# Altium schematic sheet QCPower Rev A Sht2 BLDC Controller.SchDoc
size A2
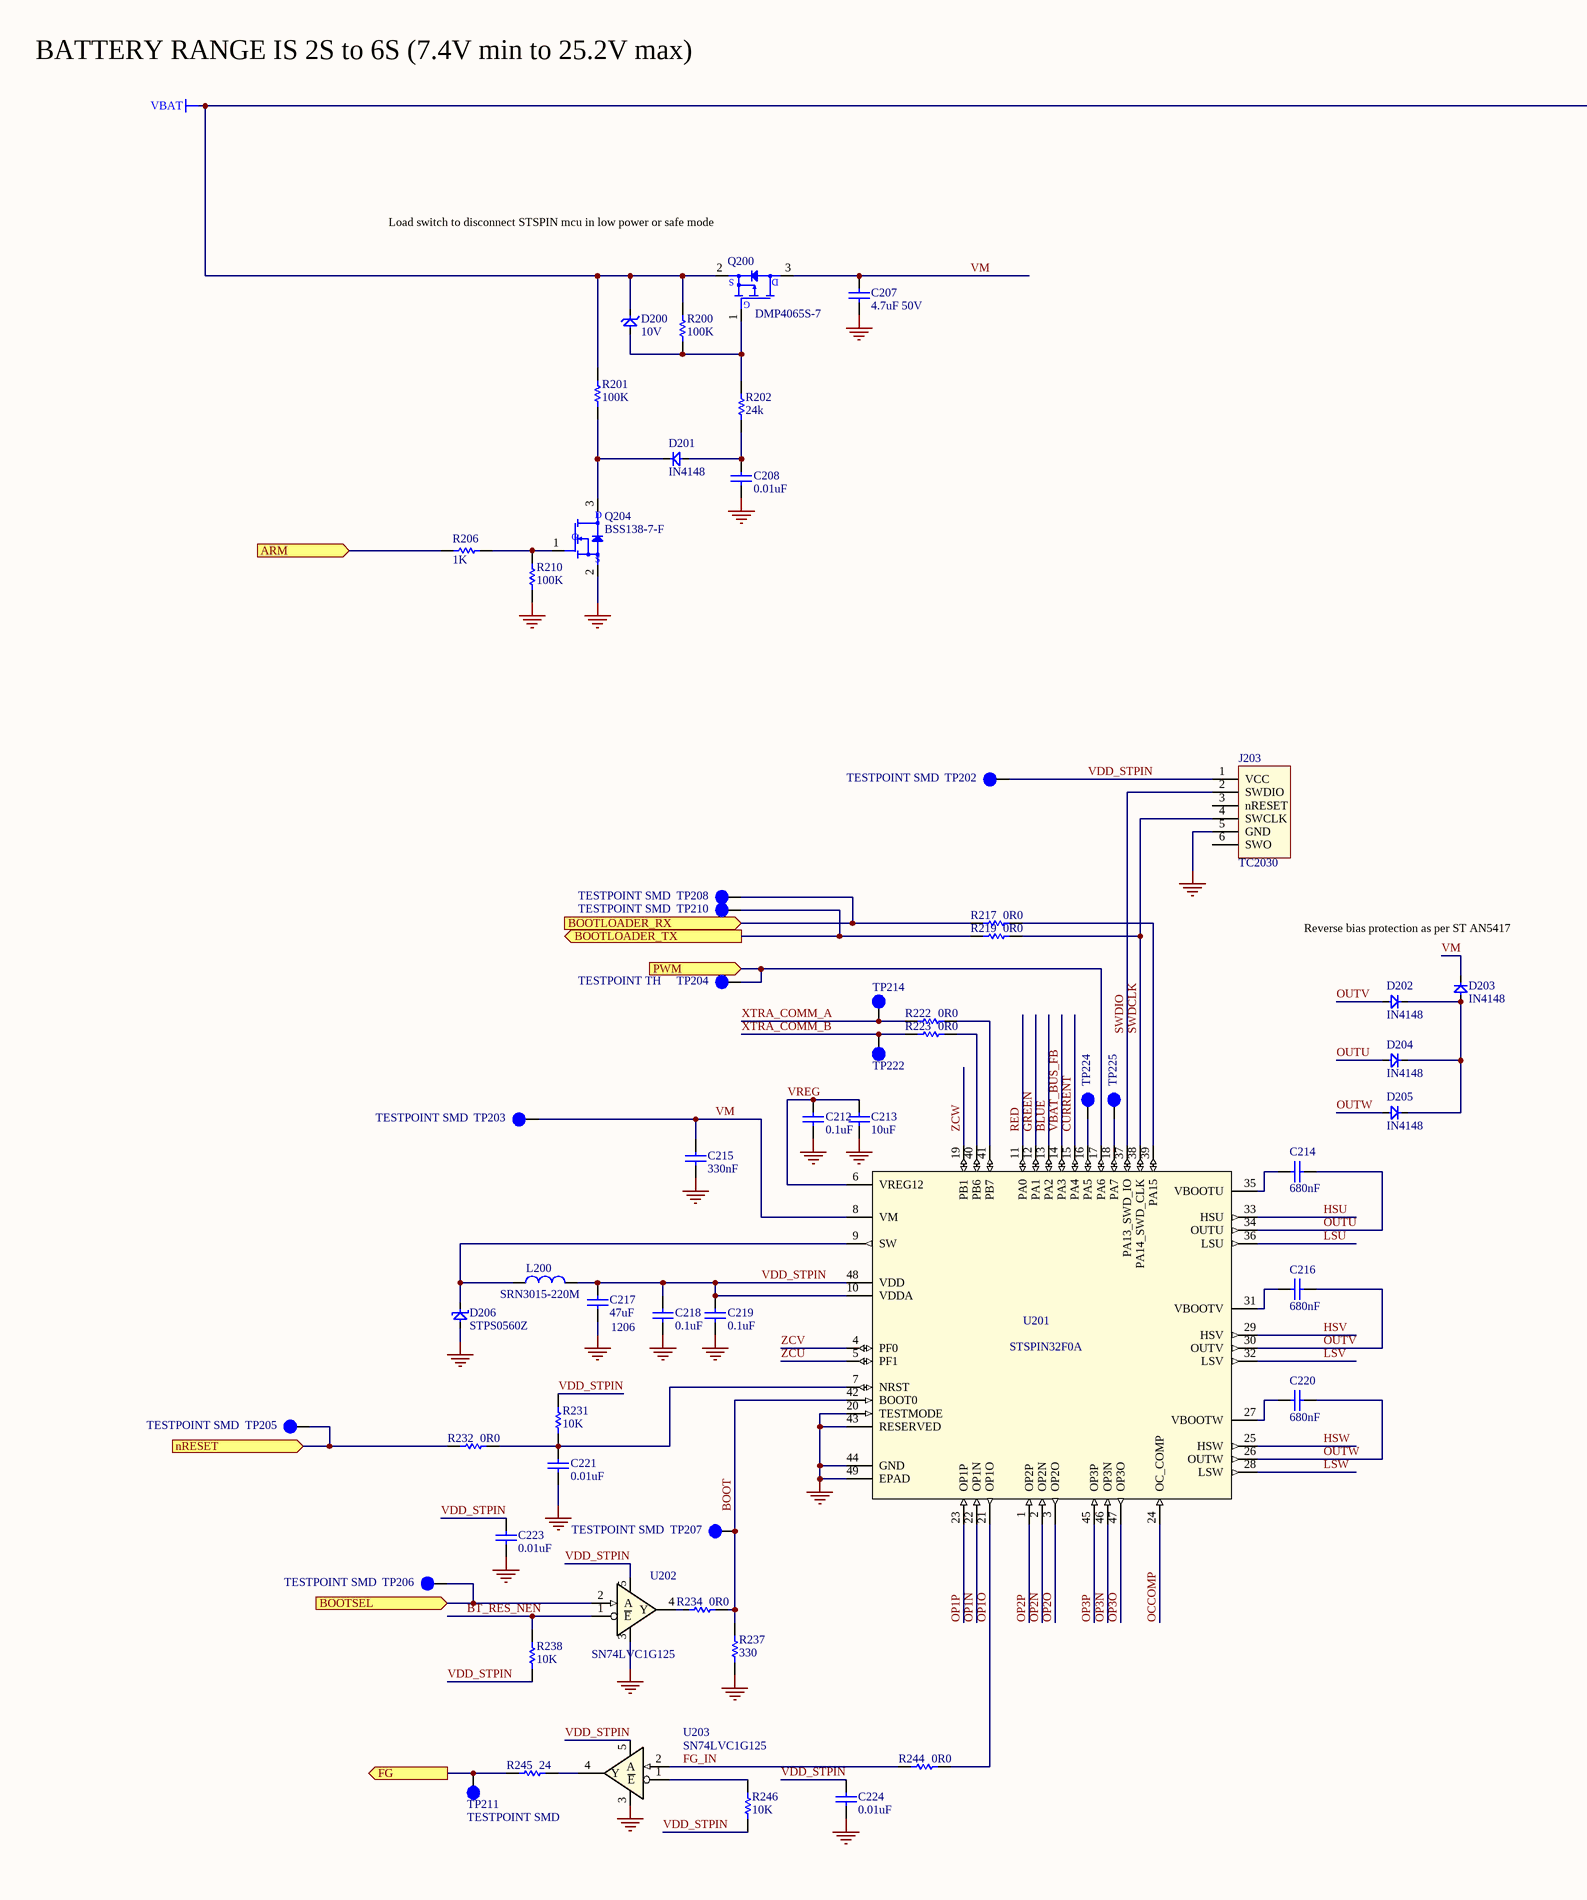
[diagram p0: QCPower Rev A Sht2 BLDC Controller.SchDoc, left]
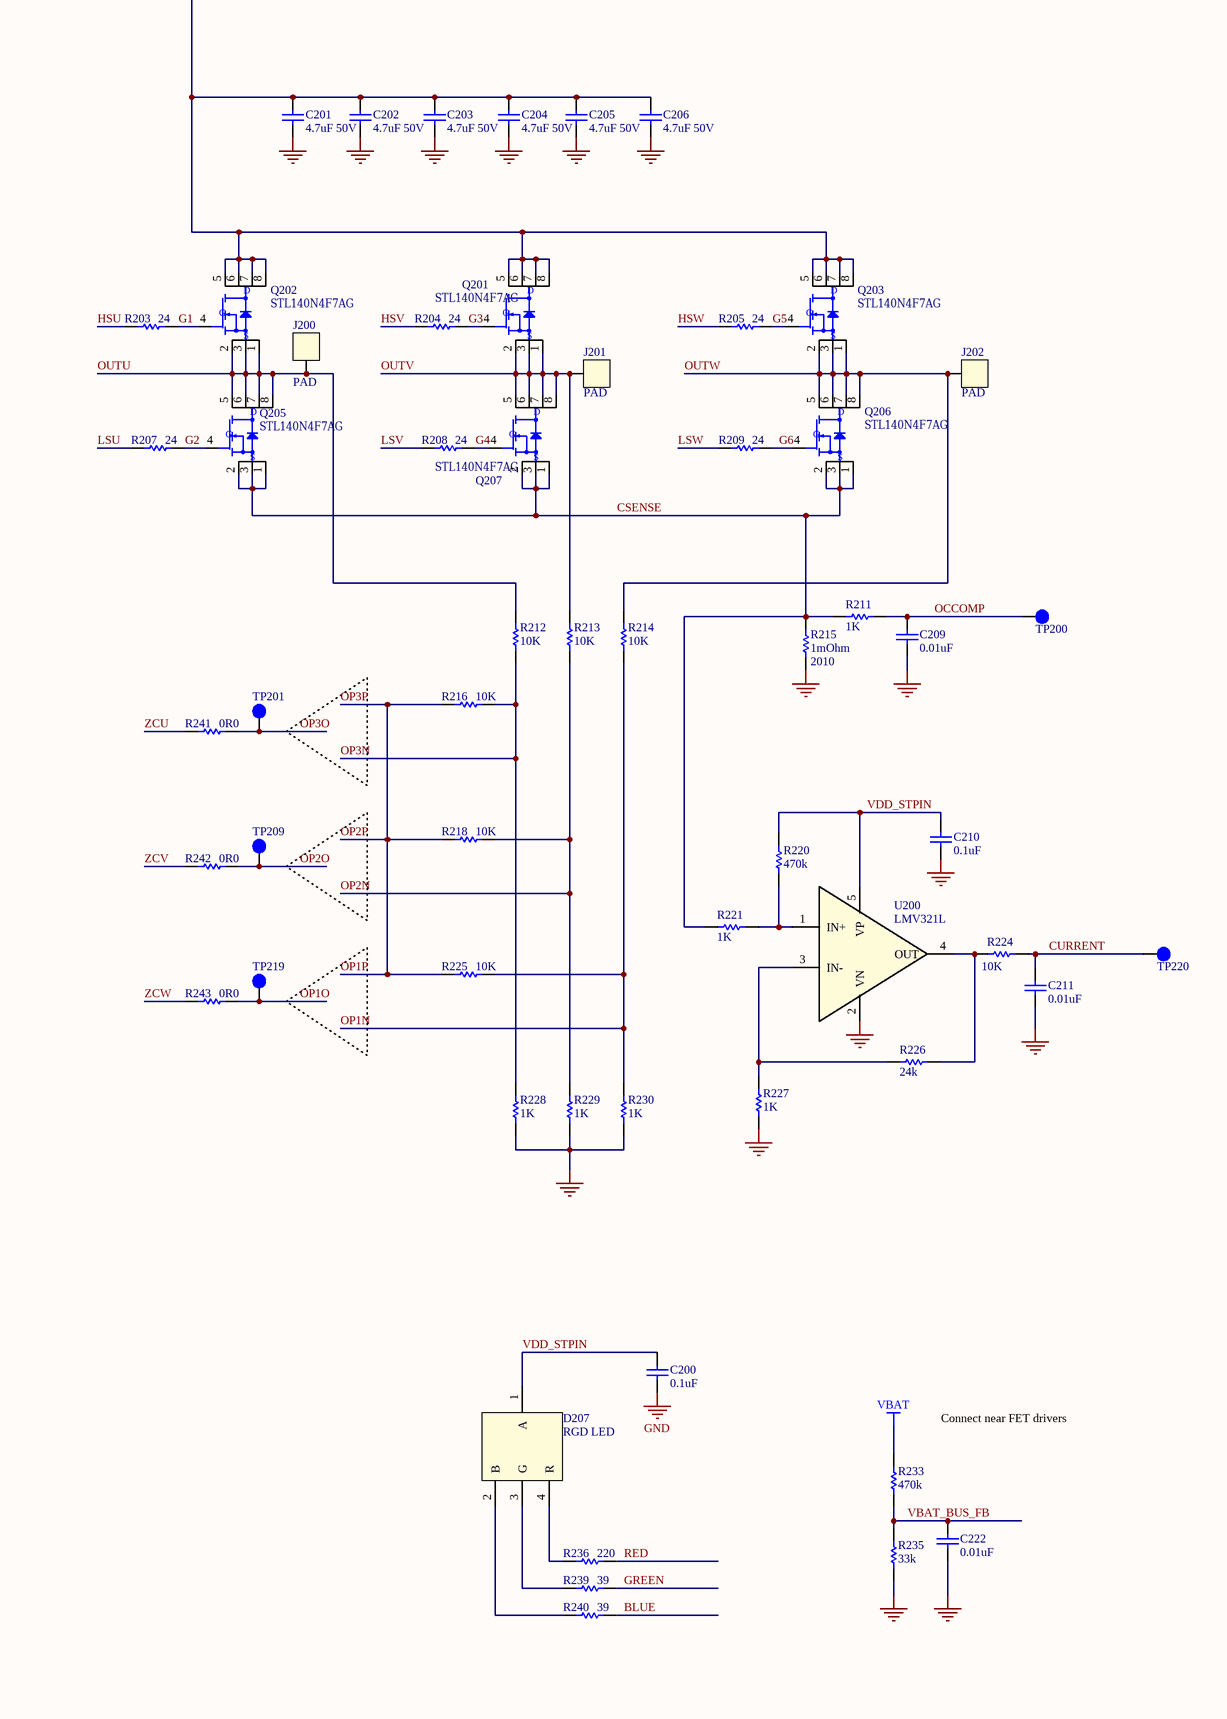
[diagram p1: QCPower Rev A Sht2 BLDC Controller.SchDoc, right]

## Parts
C200  0.1uF  [SMD CAP 0402]
C201  4.7uF 50V  [SMD CAP 0805]
C202  4.7uF 50V  [SMD CAP 0805]
C203  4.7uF 50V  [SMD CAP 0805]
C204  4.7uF 50V  [SMD CAP 0805]
C205  4.7uF 50V  [SMD CAP 0805]
C206  4.7uF 50V  [SMD CAP 0805]
C207  4.7uF 50V  [SMD CAP 0805]
C208  0.01uF  [SMD CAP 0402]
C209  0.01uF  [SMD CAP 0402]
C210  0.1uF  [SMD CAP 0402]
C211  0.01uF  [SMD CAP 0402]
C212  0.1uF  [SMD CAP 0402]
C213  10uF  [SMD CAP 0805]
C214  680nF  [SMD CAP 0603]
C215  330nF  [SMD CAP 0603]
C216  680nF  [SMD CAP 0603]
C217  47uF  4. Package: 1206  [SMD CAP 1206]
C218  0.1uF  [SMD CAP 0402]
C219  0.1uF  [SMD CAP 0402]
C220  680nF  [SMD CAP 0603]
C221  0.01uF  [SMD CAP 0402]
C222  0.01uF  [SMD CAP 0402]
C223  0.01uF  [SMD CAP 0402]
C224  0.01uF  [SMD CAP 0402]
D200  10V  [DIODE SOD-523]
D201  IN4148  [DIODE SOD-523]
D202  IN4148  [DIODE SOD-523]
D203  IN4148  [DIODE SOD-523]
D204  IN4148  [DIODE SOD-523]
D205  IN4148  [DIODE SOD-523]
D206  STPS0560Z  [DIODE SOD123]
D207  RGD LED  [PLCC-4 LED ASMB-MTB0-0A3A2]
J200  PAD  [CONN SOLDER MOTOR]  (no BOM)
J201  PAD  [CONN SOLDER MOTOR]  (no BOM)
J202  PAD  [CONN SOLDER MOTOR]  (no BOM)
J203  TC2030  [tag-connect-6]
L200  SRN3015-220M  [INDUCTOR SRN3015-220M]
Q200  DMP4065S-7  [SOT-23-3]
Q201  STL140N4F7AG‎  [PowerFLAT 5x6]
Q202  STL140N4F7AG‎  [PowerFLAT 5x6]
Q203  STL140N4F7AG‎  [PowerFLAT 5x6]
Q204  BSS138-7-F  [SOT-23-3]
Q205  STL140N4F7AG‎  [PowerFLAT 5x6]
Q206  STL140N4F7AG‎  [PowerFLAT 5x6]
Q207  STL140N4F7AG‎  [PowerFLAT 5x6]
R200  100K  [SMD RES 0402]
R201  100K  [SMD RES 0402]
R202  24k  [SMD RES 0402]
R203  24  [SMD RES 0402]
R204  24  [SMD RES 0402]
R205  24  [SMD RES 0402]
R206  1K  [SMD RES 0402]
R207  24  [SMD RES 0402]
R208  24  [SMD RES 0402]
R209  24  [SMD RES 0402]
R210  100K  [SMD RES 0402]
R211  1K  [SMD RES 0402]
R212  10K  [SMD RES 0402]
R213  10K  [SMD RES 0402]
R214  10K  [SMD RES 0402]
R215  1mOhm  4. Package: 2010  [SMD RES 2010]
R216  10K  [SMD RES 0402]
R217  0R0  [SMD RES 0402]
R218  10K  [SMD RES 0402]
R219  0R0  [SMD RES 0402]
R220  470k  [SMD RES 0402]
R221  1K  [SMD RES 0402]
R222  0R0  [SMD RES 0402]
R223  0R0  [SMD RES 0402]
R224  10K  [SMD RES 0402]
R225  10K  [SMD RES 0402]
R226  24k  [SMD RES 0402]
R227  1K  [SMD RES 0402]
R228  1K  [SMD RES 0402]
R229  1K  [SMD RES 0402]
R230  1K  [SMD RES 0402]
R231  10K  [SMD RES 0402]
R232  0R0  [SMD RES 0402]
R233  470k  [SMD RES 0402]
R234  0R0  [SMD RES 0402]
R235  33k  [SMD RES 0402]
R236  220  [SMD RES 0402]
R237  330  [SMD RES 0402]
R238  10K  [SMD RES 0402]
R239  39  [SMD RES 0402]
R240  39  [SMD RES 0402]
R241  0R0  [SMD RES 0402]
R242  0R0  [SMD RES 0402]
R243  0R0  [SMD RES 0402]
R244  0R0  [SMD RES 0402]
R245  24  [SMD RES 0402]
R246  10K  [SMD RES 0402]
TP200  TESTPOINT SMD  [TESTPOINT 0.5mm DIA]  (value not drawn)  (no BOM)
TP201  TESTPOINT SMD  [TESTPOINT 0.5mm DIA]  (value not drawn)  (no BOM)
TP202  TESTPOINT SMD  [TESTPOINT 0.5mm DIA]  (no BOM)
TP203  TESTPOINT SMD  [TESTPOINT 0.5mm DIA]  (no BOM)
TP204  TESTPOINT TH  [TESTPOINT TH]
TP205  TESTPOINT SMD  [TESTPOINT 0.5mm DIA]  (no BOM)
TP206  TESTPOINT SMD  [TESTPOINT 0.5mm DIA]  (no BOM)
TP207  TESTPOINT SMD  [TESTPOINT 0.5mm DIA]  (no BOM)
TP208  TESTPOINT SMD  [TESTPOINT 0.5mm DIA]  (no BOM)
TP209  TESTPOINT SMD  [TESTPOINT 0.5mm DIA]  (value not drawn)  (no BOM)
TP210  TESTPOINT SMD  [TESTPOINT 0.5mm DIA]  (no BOM)
TP211  TESTPOINT SMD  [TESTPOINT 0.5mm DIA]  (no BOM)
TP214  TESTPOINT SMD  [TESTPOINT 0.5mm DIA]  (value not drawn)  (no BOM)
TP219  TESTPOINT SMD  [TESTPOINT 0.5mm DIA]  (value not drawn)  (no BOM)
TP220  TESTPOINT SMD  [TESTPOINT 0.5mm DIA]  (value not drawn)  (no BOM)
TP222  TESTPOINT SMD  [TESTPOINT 0.5mm DIA]  (value not drawn)  (no BOM)
TP224  TESTPOINT SMD  [TESTPOINT 0.5mm DIA]  (value not drawn)  (no BOM)
TP225  TESTPOINT SMD  [TESTPOINT 0.5mm DIA]  (value not drawn)  (no BOM)
U200  LMV321L  [SOT-23-5]
U201  STSPIN32F0A  [VQFN-48 7x7]
U202  SN74LVC1G125  [SC70-5]
U203  SN74LVC1G125  [SC70-5]

## Ports
ARM (in), BOOTLOADER_RX (in), BOOTLOADER_TX (out), BOOTSEL (in), FG (out), nRESET (in), PWM (in)

## Nets
GND: C200.1 C201.2 C202.2 C203.2 C204.2 C205.2 C206.2 C207.2 C208.2 C209.2 C210.1 C211.2 C212.1 C213.2 C215.2 C217.2 C218.1 C219.1 C221.2 C222.2 C223.2 C224.2 D206.A J203.5(GND) Q204.2 R210.2 R215.1 R227.2 R228.1 R229.1 R230.1 R235.2 R237.1 U200.2(VN) U201.20(TESTMODE) U201.43(RESERVED) U201.44(GND) U201.49(EPAD) U202.3(GND) U203.3(GND)
VBAT: C201.1 C202.1 C203.1 C204.1 C205.1 C206.1 D200.K Q200.2 Q201.5(D) Q201.6(D) Q201.7(D) Q201.8(D) Q202.5(D) Q202.6(D) Q202.7(D) Q202.8(D) Q203.5(D) Q203.6(D) Q203.7(D) Q203.8(D) R200.1 R201.1 R233.1
ARM: R206.2 ; port ARM
BLUE: R240.2 U201.13(PA2)
BOOT: R234.2 R237.2 TP207.1 U201.42(BOOT0)
BOOTLOADER_RX: R217.1 TP208.1 ; port BOOTLOADER_RX
BOOTLOADER_TX: R219.1 TP210.1 ; port BOOTLOADER_TX
BOOTSEL: TP206.1 U202.2(A) ; port BOOTSEL
BT_RES_NEN: R238.1 U202.1(~{E})
CSENSE: Q205.1(S) Q205.2(S) Q205.3(S) Q206.1(S) Q206.2(S) Q206.3(S) Q207.1(S) Q207.2(S) Q207.3(S) R211.2 R215.2 R221.2
CURRENT: C211.1 R224.2 TP220.1 U201.15(PA4)
FG: R245.1 TP211.1 ; port FG
FG_IN: R244.1 U203.2(A)
G1: Q202.4(G) R203.2
G2: Q205.4(G) R207.2
G3: Q201.4(G) R204.2
G4: Q207.4(G) R208.2
G5: Q203.4(G) R205.2
G6: Q206.4(G) R209.2
GREEN: R239.2 U201.12(PA1)
HSU: R203.1 U201.33(HSU)
HSV: R204.1 U201.29(HSV)
HSW: R205.1 U201.25(HSW)
LSU: R207.1 U201.36(LSU)
LSV: R208.1 U201.32(LSV)
LSW: R209.1 U201.28(LSW)
nRESET: R232.1 TP205.1 ; port nRESET
OCCOMP: C209.1 R211.1 TP200.1 U201.24(OC_COMP)
OP1N: R214.2 R225.1 R230.2 U201.22(OP1N)
OP1O: R243.2 R244.2 TP219.1 U201.21(OP1O)
OP1P: R216.2 R218.2 R225.2 U201.1(OP2P) U201.23(OP1P) U201.45(OP3P)  [also labelled OP2P, OP3P]
OP2N: R213.2 R218.1 R229.2 U201.2(OP2N)
OP2O: R242.2 TP209.1 U201.3(OP2O)
OP3N: R212.2 R216.1 R228.2 U201.46(OP3N)
OP3O: R241.2 TP201.1 U201.47(OP3O)
OUTU: C214.2 D204.A J200.1 Q202.1(S) Q202.2(S) Q202.3(S) Q205.5(D) Q205.6(D) Q205.7(D) Q205.8(D) R212.1 U201.34(OUTU)
OUTV: C216.2 D202.A J201.1 Q201.1(S) Q201.2(S) Q201.3(S) Q207.5(D) Q207.6(D) Q207.7(D) Q207.8(D) R213.1 U201.30(OUTV)
OUTW: C220.2 D205.A J202.1 Q203.1(S) Q203.2(S) Q203.3(S) Q206.5(D) Q206.6(D) Q206.7(D) Q206.8(D) R214.1 U201.26(OUTW)
PWM: TP204.1 U201.17(PA6) ; port PWM
RED: R236.2 U201.11(PA0)
SWDCLK: J203.4(SWCLK) R219.2 U201.38(PA14_SWD_CLK)
SWDIO: J203.2(SWDIO) U201.37(PA13_SWD_IO)
VBAT_BUS_FB: C222.1 R233.2 R235.1 U201.14(PA3)
VDD_STPIN: C200.2 C210.2 C217.1 C218.2 C219.2 C223.1 C224.1 D207.1(A) J203.1(VCC) L200.2 R220.1 R231.1 R238.2 R246.2 TP202.1 U200.5(VP) U201.10(VDDA) U201.48(VDD) U202.5(VCC) U203.5(VCC)
VM: C207.1 C215.1 D203.K Q200.3 TP203.1 U201.8(VM)
VREG: C212.2 C213.1 U201.6(VREG12)
XTRA_COMM_A: R222.1 TP214.1
XTRA_COMM_B: R223.1 TP222.1
ZCU: R241.1 U201.5(PF1)
ZCV: R242.1 U201.4(PF0)
ZCW: R243.1 U201.19(PB1)
NetC208_1: C208.1 D201.A R202.1
NetC214_1: C214.1 U201.35(VBOOTU)
NetC216_1: C216.1 U201.31(VBOOTV)
NetC220_1: C220.1 U201.27(VBOOTW)
NetC221_1: C221.1 R231.2 R232.2 U201.7(NRST)
NetD200_A: D200.A Q200.1 R200.2 R202.2
NetD201_K: D201.K Q204.3 R201.2
NetD202_K: D202.K D203.A D204.K D205.K
NetD206_K: D206.K L200.1 U201.9(SW)
NetD207_2: D207.2(B) R240.1
NetD207_3: D207.3(G) R239.1
NetD207_4: D207.4(R) R236.1
NetQ204_1: Q204.1(G) R206.1 R210.1
NetR217_2: R217.2 U201.39(PA15)
NetR220_2: R220.2 R221.1 U200.1(IN+)
NetR222_2: R222.2 U201.41(PB7)
NetR223_2: R223.2 U201.40(PB6)
NetR224_1: R224.1 R226.2 U200.4(OUT)
NetR226_1: R226.1 R227.1 U200.3(IN-)
NetR234_1: R234.1 U202.4(Y)
NetR245_2: R245.2 U203.4(Y)
NetR246_1: R246.1 U203.1(~{E})
NetTP224_1: TP224.1 U201.16(PA5)
NetTP225_1: TP225.1 U201.18(PA7)

Not connected (* = marked no-connect by the designer): J203 3(nRESET) 6(SWO)

## Notes on the sheet
- BATTERY RANGE IS 2S to 6S (7.4V min to 25.2V max)
- (near Q200) Load switch to disconnect STSPIN mcu in low power or safe mode
- Reverse bias protection as per ST AN5417
- Connect near FET drivers
- (in symbol TRANS FET N-CH 50V 200MA SOT23-3 BSS138-7-F) D; S
- (in symbol TRANS FET P-CH 40V 2.4A SOT23-3) S; D; G

## Library data of the parts
C200 C210 C212 C218 C219 = CAP MLCC SMD: CAP CER 0.1UF 25V X7R 0402; 1. Manufacturer: Yageo; 2. Manufacturer Part Number: CC0402KRX7R8BB104; 4. Package: 0402; 3. Date Modified: 20201122
C201-C207 = CAP MLCC SMD: CAP CER 4.7UF 50V X5R 0805; 1. Manufacturer: Samsung Electro-Mechanics; 2. Manufacturer Part Number: CL21A475KBQNNNE; 4. Package: 0805; 3. Date Modified: 20201125
C208 C209 C211 C221-C224 = CAP MLCC SMD: CAP CER 10000PF 16V X7R 0402; 1. Manufacturer: Walsin Technology Corporation; 2. Manufacturer Part Number: 0402B103K160CT; 4. Package: 0402; 3. Date Modified: 20201122
C213 = CAP MLCC SMD: CAP CER 10UF 25V X5R 0805; 1. Manufacturer: Taiyo Yuden; 2. Manufacturer Part Number: TMK212BBJ106KG-T; 4. Package: 0805; 3. Date Modified: 20201219
C214 C216 C220 = CAP MLCC SMD: CAP CER 0.68UF 25V X7R 0603; 1. Manufacturer: TDK Corporation; 2. Manufacturer Part Number: CGA3E1X7R1E684K080AC; 4. Package: 0603; 3. Date Modified: 20201125
C215 = CAP MLCC SMD: CAP CER 0.33UF 50V X7R 0603; 1. Manufacturer: TDK Corporation; 2. Manufacturer Part Number: C1608X7R1H334K080AC; 4. Package: 0402; 3. Date Modified: 20201125
C217 = CAP MLCC SMD: CAP CER 47UF 10V X5R 1206; 1. Manufacturer: Murata Electronics; 2. Manufacturer Part Number: GRM31CR61A476ME15L; 3. Date Modified: 20200805
D200 = DIODE ZENER: DIODE ZENER 10V 350MW SOD523; 1. Manufacturer: Diodes Incorporated; 2. Manufacturer Part Number: BZT585B10T-7; 3. Date Modified: 20201128
D201-D205 = DIODE STANDARD: DIODE GEN PURP 75V 200MA SOD523F; 1. Manufacturer: ON Semiconductor; 2. Manufacturer Part Number: 1N4148WT; 3. Date Modified: 20201128
D206 = DIODE SCHOTTKY: DIODE SCHOTTKY 60V 500MA SOD123; 1. Manufacturer: STMicroelectronics; 2. Manufacturer Part Number: STPS0560Z; 3. Date Modified: 20201125
D207 = LED RGB DIFFUSED 4PLCC SMD: 1. Manufacturer: Broadcom Limited; 2. Manufacturer Part Number: ASMB-MTB0-0A3A2; 3. Date Modified: 20201125
J200-J202 = CONN SOLDER MOTOR 7x5: 1. Manufacturer: *; 2. Manufacturer Part Number: *; 3. Date Modified: *
J203 = TC2030: TC2030 PGM PADS; 1. Manufacturer: NA; 2. Manufacturer Part Number: NA
L200 = INDUCTOR: IND FIXED 22UH 600MA 622MOHM SMD; 1. Manufacturer: Bourns Inc.; 2. Manufacturer Part Number: SRN3015-220M; 3. Date Modified: 20210101
Q200 = TRANS FET P-CH 40V 2.4A SOT23-3: 1. Manufacturer: Diodes Incorporated; 2. Manufacturer Part Number: DMP4065S-7; 3. Date Modified: 20201128
Q201-Q203 Q205-Q207 = TRANS FET N-CH 60V 145A 8PWRFLAT STL140N6F7: MOSFET N-CH 40V 120A POWERFLAT; 1. Manufacturer: STMicroelectronics; 2. Manufacturer Part Number: STL140N4F7AG‎; 3. Date Modified: 20201118
Q204 = TRANS FET N-CH 50V 200MA SOT23-3 BSS138-7-F: 1. Manufacturer: Diodes Incorporated; 2. Manufacturer Part Number: BSS138-7-F; 3. Date Modified: 20201128
R200 R201 R210 = RES SMD: RES SMD 100K OHM 1% 1/16W 0402; 1. Manufacturer: Yageo; 2. Manufacturer Part Number: RC0402FR-07100KL; 4. Package: 0402; 3. Date Modified: 20201128
R202 R226 = RES SMD: RES SMD 24K OHM 1% 1/16W 0402; 1. Manufacturer: Yageo; 2. Manufacturer Part Number: RC0402FR-0724KL; 4. Package: 0402; 3. Date Modified: 20201125
R203-R205 R207-R209 R245 = RES SMD: RES SMD 24 OHM 5% 1/10W 0402; 1. Manufacturer: Panasonic Electronic Components; 2. Manufacturer Part Number: ERJ-2GEJ240X; 4. Package: 0402; 3. Date Modified: 20201121
R206 R211 R221 R227-R230 = RES SMD: RES SMD 1K OHM 1% 1/16W 0402; 1. Manufacturer: Yageo; 2. Manufacturer Part Number: RC0402FR-071KL; 4. Package: 0402; 3. Date Modified: 20201122
R212-R214 R216 R218 R224 R225 R231 R238 R246 = RES SMD: RES SMD 10K OHM 1% 1/16W 0402; 1. Manufacturer: Yageo; 2. Manufacturer Part Number: RC0402FR-0710KL; 4. Package: 0402; 3. Date Modified: 20201122
R215 = RES SMD: RES 0.001 OHM 1% 1.5W 2010; 1. Manufacturer: Stackpole Electronics Inc; 2. Manufacturer Part Number: CSNL2010FT1L00; 3. Date Modified: 20201125
R217 R219 R222 R223 R232 R234 R241-R244 = RES SMD: RES SMD 0 OHM JUMPER 1/16W 0402; 1. Manufacturer: Yageo; 2. Manufacturer Part Number: RC0402FR-070RL; 4. Package: 0402; 3. Date Modified: 20201122
R220 R233 = RES SMD: RES SMD 470K OHM 1% 1/16W 0402; 1. Manufacturer: Yageo; 2. Manufacturer Part Number: RC0402FR-07470KL; 4. Package: 0402; 3. Date Modified: 20201125
R235 = RES SMD: RES SMD 33K OHM 1% 1/16W 0402; 1. Manufacturer: Yageo; 2. Manufacturer Part Number: RC0402FR-0733KL; 4. Package: 0402; 3. Date Modified: 20201125
R236 = RES SMD: RES SMD 220 OHM 5% 1/16W 0402; 1. Manufacturer: Yageo; 2. Manufacturer Part Number: RC0402JR-07220RL; 4. Package: 0402; 3. Date Modified: 20201125
R237 = RES SMD: RES SMD 330 OHM 5% 1/16W 0402; 1. Manufacturer: Yageo; 2. Manufacturer Part Number: RC0402JR-07330RL; 4. Package: 0402; 3. Date Modified: 20201125
R239 R240 = RES SMD: RES SMD 39 OHM 5% 1/16W 0402; 1. Manufacturer: Yageo; 2. Manufacturer Part Number: RC0402JR-0739RL; 4. Package: 0402; 3. Date Modified: 20201125
TP200-TP203 TP205-TP211 TP214 TP219 TP220 TP222 TP224 TP225 = TESTPOINT PAD: TESTPOINT SMD PAD; 1. Manufacturer: *; 2. Manufacturer Part Number: *; 3. Date Modified: *
TP204 = TESTPOINT TH: TESTPOINT TH KEYSTONE; 1. Manufacturer: Keystone Electronics; 2. Manufacturer Part Number: 5002; 3. Date Modified: 20200805
U200 = IC OPAMP GP 1 CIRCUIT SOT23-5: 1. Manufacturer: STMicroelectronics; 2. Manufacturer Part Number: LMV321LILT; 3. Date Modified: 202010101
U201 = IC BLDC CONTROLLER STSPIN32F0A: 1. Manufacturer: ST; 2. Manufacturer Part Number: STSPIN32F0A; 3. Date Modified: 20201118
U202 U203 = IC BUF TRI-STATE NON-INVERT 5.5V SC70-5: 1. Manufacturer: Texas Instruments; 2. Manufacturer Part Number: SN74LVC1G125DCKR; 3. Date Modified: 20200828